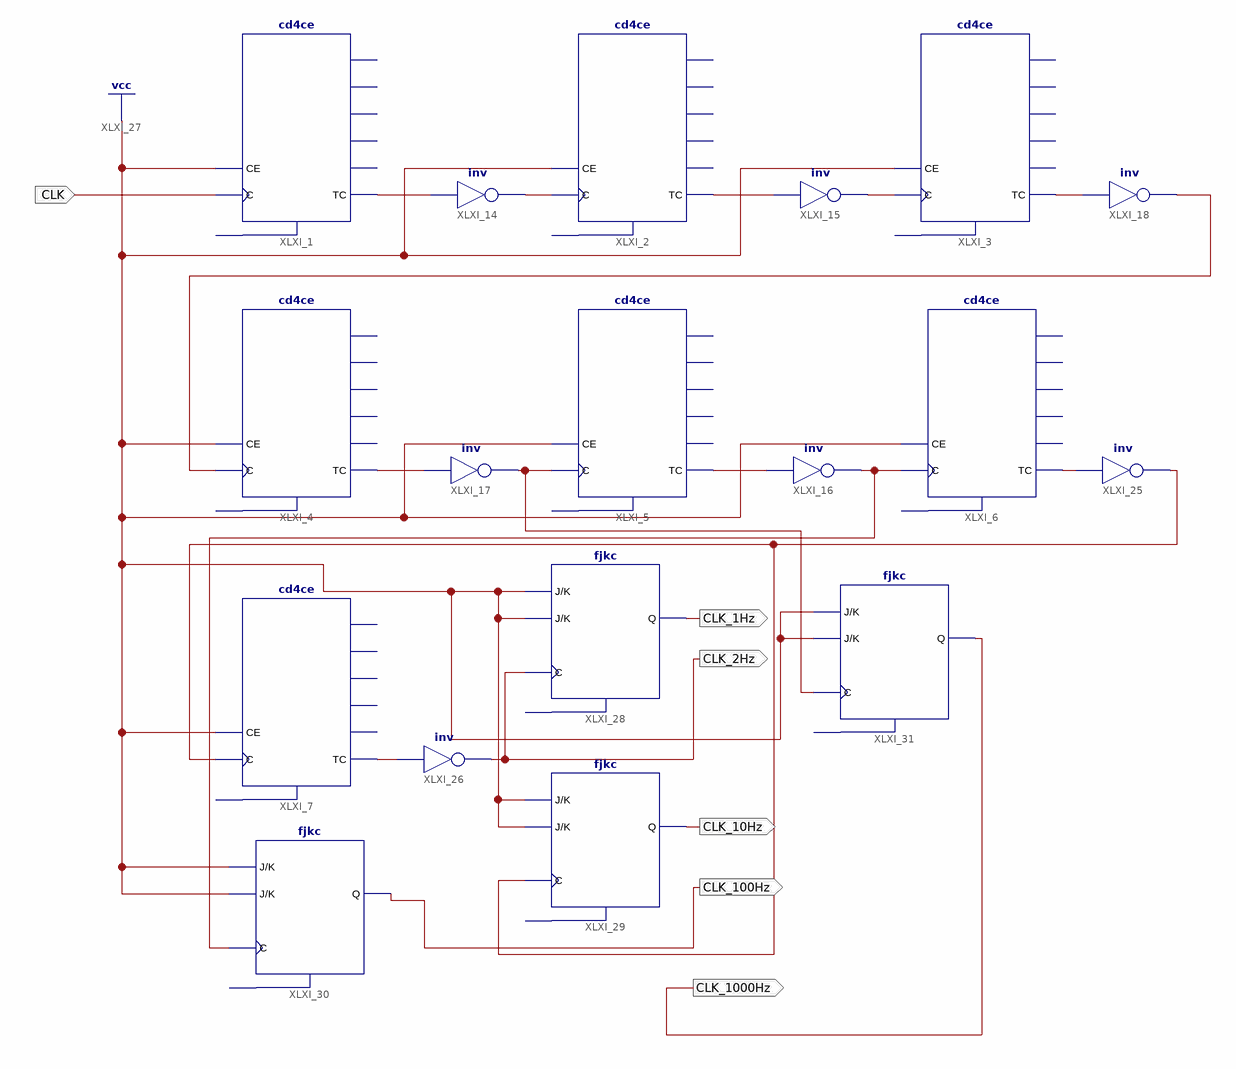
[diagram p0: schematic sheet 1]
// Xilinx ISE schematic ClockDivisor.sch (spartan6) as structural Verilog: 18 symbols, 6 ports
module ClockDivisor (
  input  CLK,
  output CLK_2Hz,
  output CLK_1Hz,
  output CLK_10Hz,
  output CLK_100Hz,
  output CLK_1000Hz
);

  wire XLXN_2, XLXN_3, XLXN_4, XLXN_5, XLXN_6, XLXN_7, XLXN_8, XLXN_14, XLXN_15, XLXN_16, XLXN_18, XLXN_19,
       XLXN_28;

  cd4ce XLXI_1 (.C(CLK), .CE(1'b1), .TC(XLXN_2));  // open: CLR, CEO, Q0, Q1, Q2, Q3
  cd4ce XLXI_2 (.C(XLXN_3), .CE(1'b1), .TC(XLXN_4));  // open: CLR, CEO, Q0, Q1, Q2, Q3
  cd4ce XLXI_3 (.C(XLXN_5), .CE(1'b1), .TC(XLXN_14));  // open: CLR, CEO, Q0, Q1, Q2, Q3
  not XLXI_14 (XLXN_3, XLXN_2);
  not XLXI_15 (XLXN_5, XLXN_4);
  not XLXI_18 (XLXN_15, XLXN_14);
  cd4ce XLXI_4 (.C(XLXN_15), .CE(1'b1), .TC(XLXN_6));  // open: CLR, CEO, Q0, Q1, Q2, Q3
  cd4ce XLXI_7 (.C(XLXN_18), .CE(1'b1), .TC(XLXN_19));  // open: CLR, CEO, Q0, Q1, Q2, Q3
  cd4ce XLXI_6 (.C(XLXN_28), .CE(1'b1), .TC(XLXN_16));  // open: CLR, CEO, Q0, Q1, Q2, Q3
  not XLXI_16 (XLXN_28, XLXN_8);
  not XLXI_17 (XLXN_7, XLXN_6);
  cd4ce XLXI_5 (.C(XLXN_7), .CE(1'b1), .TC(XLXN_8));  // open: CLR, CEO, Q0, Q1, Q2, Q3
  not XLXI_25 (XLXN_18, XLXN_16);
  not XLXI_26 (CLK_2Hz, XLXN_19);
  fjkc XLXI_28 (.C(CLK_2Hz), .J(1'b1), .K(1'b1), .Q(CLK_1Hz));  // open: CLR
  fjkc XLXI_29 (.C(XLXN_18), .J(1'b1), .K(1'b1), .Q(CLK_10Hz));  // open: CLR
  fjkc XLXI_30 (.C(XLXN_28), .J(1'b1), .K(1'b1), .Q(CLK_100Hz));  // open: CLR
  fjkc XLXI_31 (.C(XLXN_7), .J(1'b1), .K(1'b1), .Q(CLK_1000Hz));  // open: CLR
endmodule
